# EAGLE design Selecta Pi Shield V1_1 (EAGLE 9.6.2)

## Sheet 1 of 3
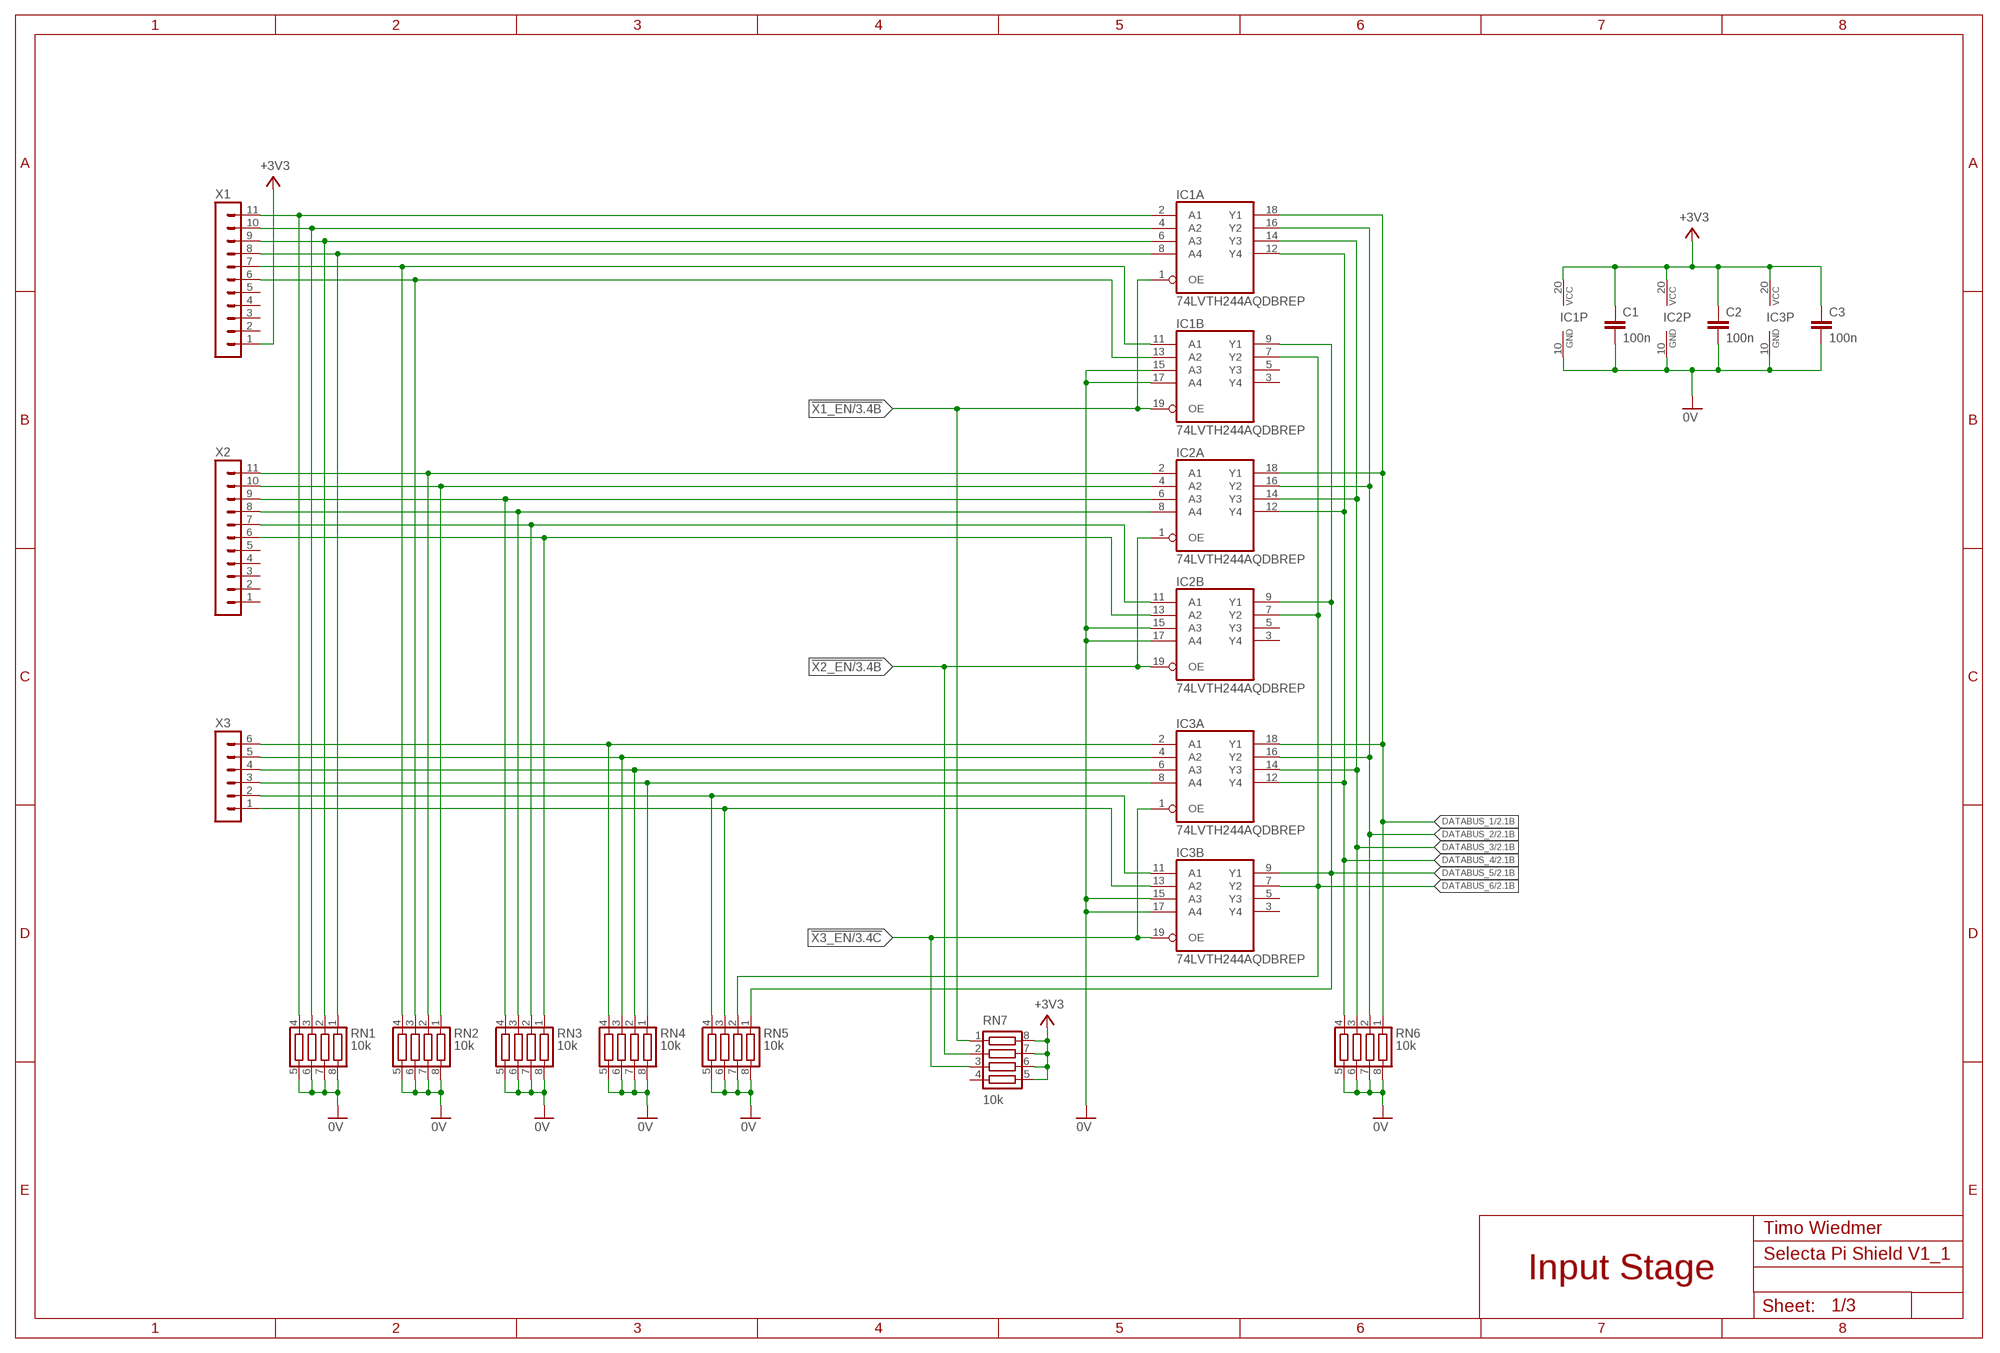
[diagram p0: schematic, sheet 1]

### Parts
C1  100n  C-EUC0603  [C0603]
C2  100n  C-EUC0603  [C0603]
C3  100n  C-EUC0603  [C0603]
IC1  74LVTH244AQDBREP  74244AQDBREP  [SSOP20]
IC2  74LVTH244AQDBREP  74244AQDBREP  [SSOP20]
IC3  74LVTH244AQDBREP  74244AQDBREP  [SSOP20]
RN1  10k  CTS742C083  [CTS742C083]
RN2  10k  CTS742C083  [CTS742C083]
RN3  10k  CTS742C083  [CTS742C083]
RN4  10k  CTS742C083  [CTS742C083]
RN5  10k  CTS742C083  [CTS742C083]
RN6  10k  CTS742C083  [CTS742C083]
RN7  10k  CTS742C083  [CTS742C083]
X1  MA11-1  [MA11-1]
X2  MA11-1  [MA11-1]
X3  MA06-1  [MA06-1]

### Nets
0V: C1.2 C2.2 C3.2 IC1.10(P:GND) IC1.15(B:A3) IC1.17(B:A4) IC2.10(P:GND) IC2.15(B:A3) IC2.17(B:A4) IC3.10(P:GND) IC3.15(B:A3) IC3.17(B:A4) RN1.5 RN1.6 RN1.7 RN1.8 RN2.5 RN2.6 RN2.7 RN2.8 RN3.5 RN3.6 RN3.7 RN3.8 RN4.5 RN4.6 RN4.7 RN4.8 RN5.5 RN5.6 RN5.7 RN5.8 RN6.5 RN6.6 RN6.7 RN6.8 ; also sheet 2,3
!X1_EN: IC1.1(A:OE) IC1.19(B:OE) RN7.1 ; also sheet 3
!X2_EN: IC2.1(A:OE) IC2.19(B:OE) RN7.2 ; also sheet 3
!X3_EN: IC3.1(A:OE) IC3.19(B:OE) RN7.3 ; also sheet 3
+3V3: C1.1 C2.1 C3.1 IC1.20(P:VCC) IC2.20(P:VCC) IC3.20(P:VCC) RN7.5 RN7.6 RN7.7 RN7.8 X1.1 ; also sheet 2,3
B_SELECT1: IC3.2(A:A1) RN4.4 X3.6
B_SELECT2: IC3.4(A:A2) RN4.3 X3.5
B_SELECT3: IC3.6(A:A3) RN4.2 X3.4
B_SELECT4: IC3.8(A:A4) RN4.1 X3.3
B_SELECT5: IC3.11(B:A1) RN5.4 X3.2
B_SELECT6: IC3.13(B:A2) RN5.3 X3.1
DATABUS_1: IC1.18(A:Y1) IC2.18(A:Y1) IC3.18(A:Y1) RN6.1 ; also sheet 2,3
DATABUS_2: IC1.16(A:Y2) IC2.16(A:Y2) IC3.16(A:Y2) RN6.2 ; also sheet 2,3
DATABUS_3: IC1.14(A:Y3) IC2.14(A:Y3) IC3.14(A:Y3) RN6.3 ; also sheet 2,3
DATABUS_4: IC1.12(A:Y4) IC2.12(A:Y4) IC3.12(A:Y4) RN6.4 ; also sheet 2,3
DATABUS_5: IC1.9(B:Y1) IC2.9(B:Y1) IC3.9(B:Y1) RN5.1 ; also sheet 2,3
DATABUS_6: IC1.7(B:Y2) IC2.7(B:Y2) IC3.7(B:Y2) RN5.2 ; also sheet 2,3
N$1: IC1.2(A:A1) RN1.4 X1.11
N$2: IC1.4(A:A2) RN1.3 X1.10
N$3: IC1.6(A:A3) RN1.2 X1.9
N$4: IC1.8(A:A4) RN1.1 X1.8
N$5: IC2.2(A:A1) RN2.2 X2.11
N$6: IC2.4(A:A2) RN2.1 X2.10
N$7: IC2.6(A:A3) RN3.4 X2.9
N$8: IC2.8(A:A4) RN3.3 X2.8
N$11: IC1.11(B:A1) RN2.4 X1.7
N$12: IC1.13(B:A2) RN2.3 X1.6
N$13: IC2.11(B:A1) RN3.2 X2.7
N$15: IC2.13(B:A2) RN3.1 X2.6
Unconnected: IC1.3(B:Y4) IC1.5(B:Y3) IC2.3(B:Y4) IC2.5(B:Y3) IC3.3(B:Y4) IC3.5(B:Y3) RN7.4 X1.2 X1.3 X1.4 X1.5 X2.1 X2.2 X2.3 X2.4 X2.5

### Notes on the sheet
- Timo Wiedmer
- Input Stage

## Sheet 2 of 3
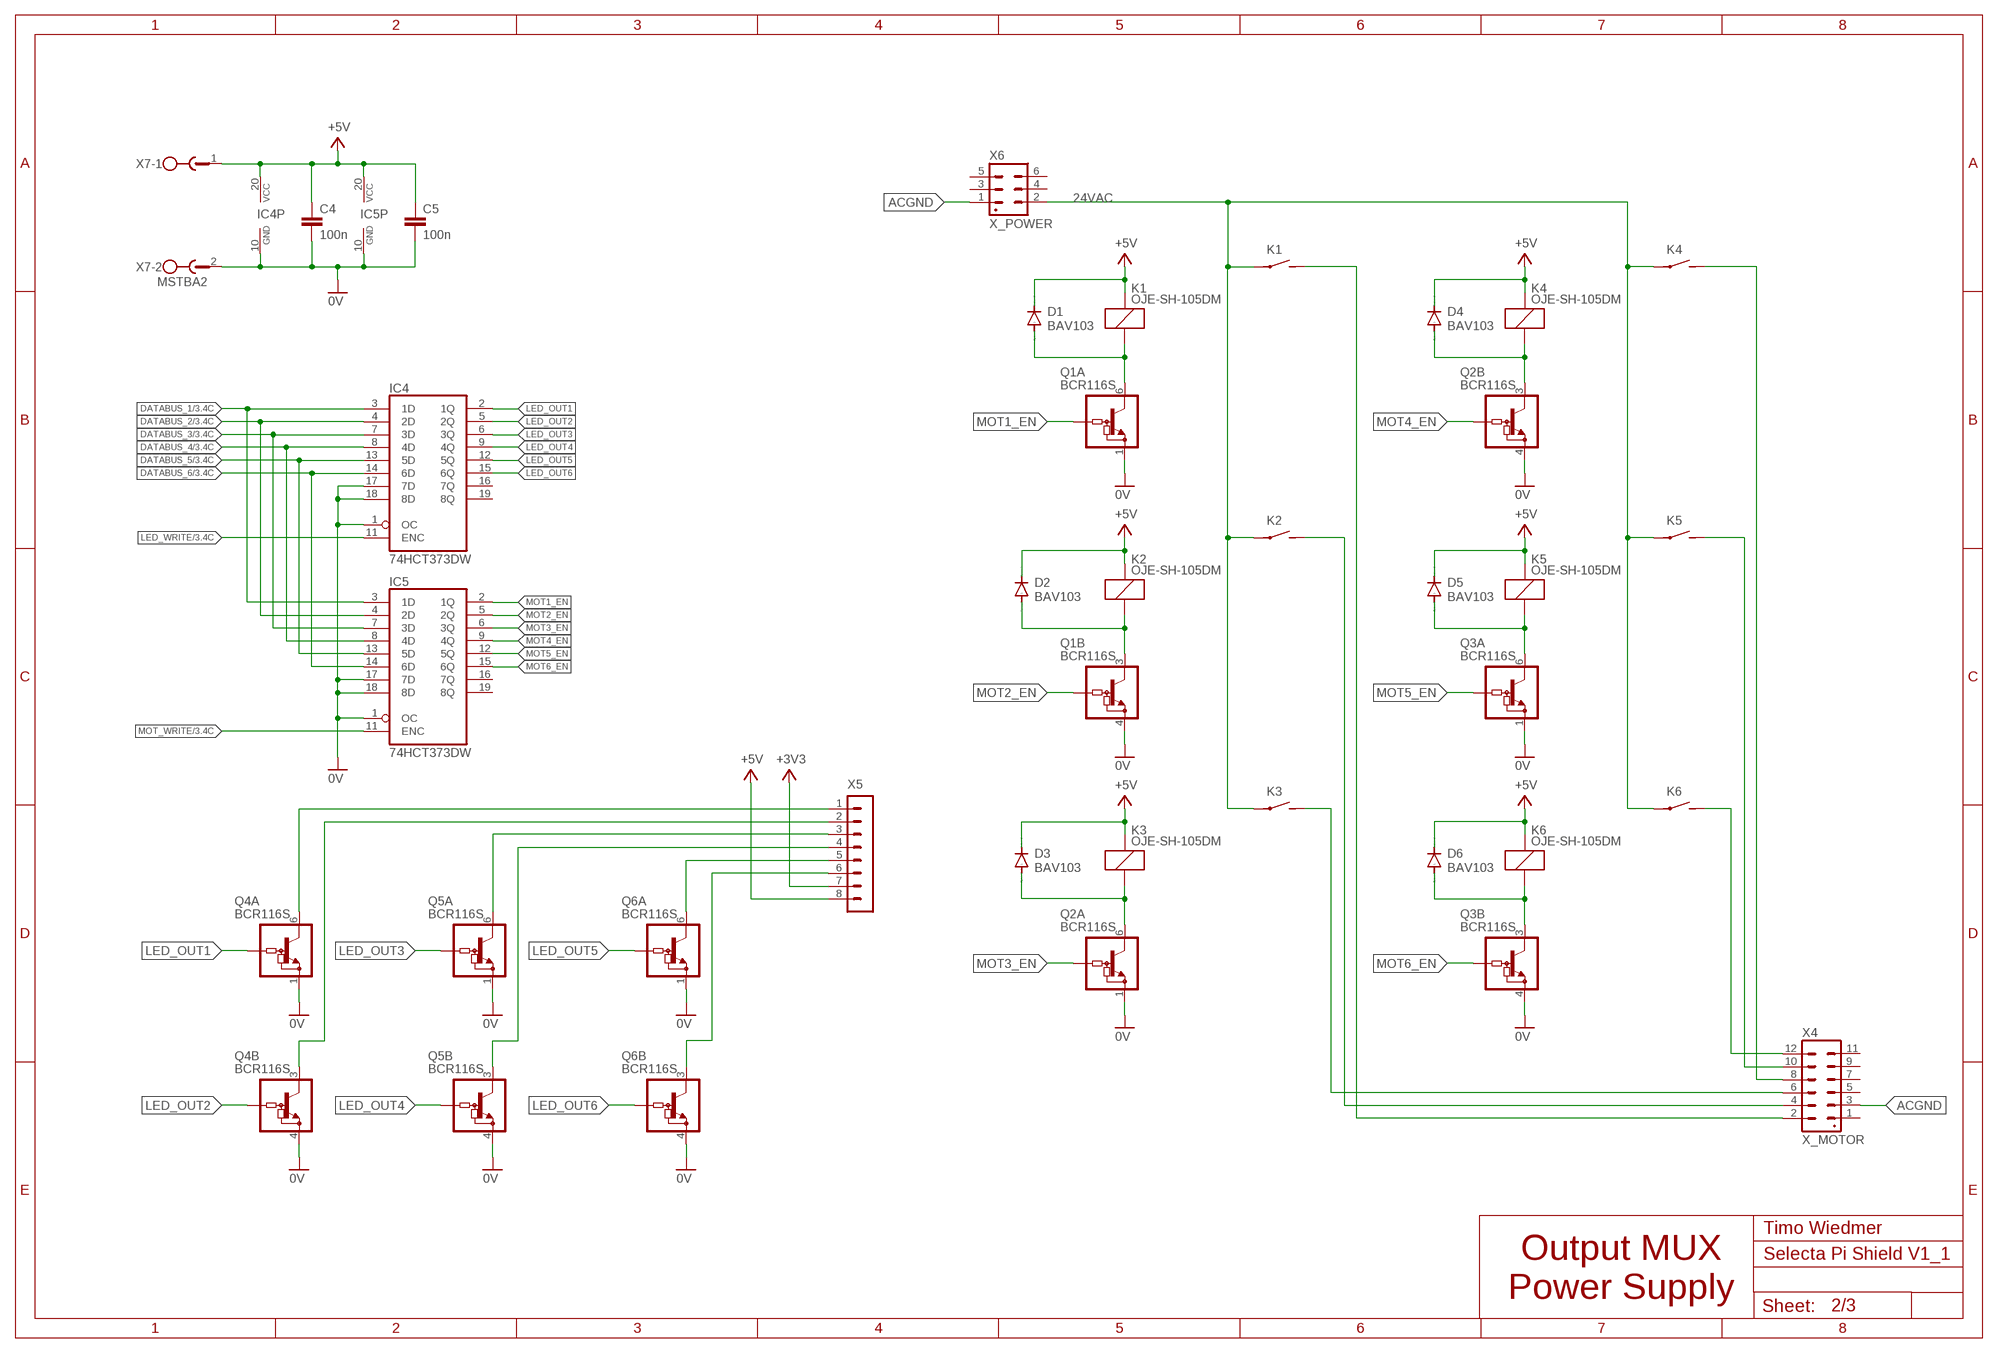
[diagram p1: schematic, sheet 2]

### Parts
C4  100n  C-EUC0603  [C0603]
C5  100n  C-EUC0603  [C0603]
D1  BAV103  [SOD-123_MINI-SMA]
D2  BAV103  [SOD-123_MINI-SMA]
D3  BAV103  [SOD-123_MINI-SMA]
D4  BAV103  [SOD-123_MINI-SMA]
D5  BAV103  [SOD-123_MINI-SMA]
D6  BAV103  [SOD-123_MINI-SMA]
IC4  74HCT373DW  [SO20W]
IC5  74HCT373DW  [SO20W]
K1  OJE-SH-105DM  [OJE-SH-105DM]
K2  OJE-SH-105DM  [OJE-SH-105DM]
K3  OJE-SH-105DM  [OJE-SH-105DM]
K4  OJE-SH-105DM  [OJE-SH-105DM]
K5  OJE-SH-105DM  [OJE-SH-105DM]
K6  OJE-SH-105DM  [OJE-SH-105DM]
Q1  BCR116S  [SOT363]
Q2  BCR116S  [SOT363]
Q3  BCR116S  [SOT363]
Q4  BCR116S  [SOT363]
Q5  BCR116S  [SOT363]
Q6  BCR116S  [SOT363]
X4  X_MOTOR  12P_MINI_FIT  [12P_MINI_FIT]
X5  MA08-1  [MA08-1]
X6  X_POWER  6P_MINI_FIT  [6P_MINI_FIT]
X7  MSTBA2  [MSTBA2]

### Nets
0V: C4.2 C5.2 IC4.1(OC) IC4.10(GND) IC4.17(7D) IC4.18(8D) IC5.1(OC) IC5.10(GND) IC5.17(7D) IC5.18(8D) Q1.1(A:E) Q1.4(B:E) Q2.1(A:E) Q2.4(B:E) Q3.1(A:E) Q3.4(B:E) Q4.1(A:E) Q4.4(B:E) Q5.1(A:E) Q5.4(B:E) Q6.1(A:E) Q6.4(B:E) X7.2 ; also sheet 1,3
24VAC: K1.COM(A:COM) K2.COM(A:COM) K3.COM(A:COM) K4.COM(A:COM) K5.COM(A:COM) K6.COM(A:COM) X6.2
24VAC_MOT1: K1.NO(A:NO) X4.2
24VAC_MOT2: K2.NO(A:NO) X4.4
24VAC_MOT3: K3.NO(A:NO) X4.6
24VAC_MOT4: K4.NO(A:NO) X4.8
24VAC_MOT5: K5.NO(A:NO) X4.10
24VAC_MOT6: K6.NO(A:NO) X4.12
+3V3: X5.7 ; also sheet 1,3
+5V: C4.1 C5.1 D1.C D2.C D3.C D4.C D5.C D6.C IC4.20(VCC) IC5.20(VCC) K1.COILA K2.COILA K3.COILA K4.COILA K5.COILA K6.COILA X5.8 X7.1 ; also sheet 3
ACGND: X4.3 X6.1
DATABUS_1: IC4.3(1D) IC5.3(1D) ; also sheet 1,3
DATABUS_2: IC4.4(2D) IC5.4(2D) ; also sheet 1,3
DATABUS_3: IC4.7(3D) IC5.7(3D) ; also sheet 1,3
DATABUS_4: IC4.8(4D) IC5.8(4D) ; also sheet 1,3
DATABUS_5: IC4.13(5D) IC5.13(5D) ; also sheet 1,3
DATABUS_6: IC4.14(6D) IC5.14(6D) ; also sheet 1,3
LED1: Q4.6(A:C) X5.1
LED2: Q4.3(B:C) X5.2
LED3: Q5.6(A:C) X5.3
LED4: Q5.3(B:C) X5.4
LED5: Q6.6(A:C) X5.5
LED6: Q6.3(B:C) X5.6
LED_OUT1: IC4.2(1Q) Q4.2(A:B)
LED_OUT2: IC4.5(2Q) Q4.5(B:B)
LED_OUT3: IC4.6(3Q) Q5.2(A:B)
LED_OUT4: IC4.9(4Q) Q5.5(B:B)
LED_OUT5: IC4.12(5Q) Q6.2(A:B)
LED_OUT6: IC4.15(6Q) Q6.5(B:B)
LED_WRITE: IC4.11(ENC) ; also sheet 3
MOT1_EN: IC5.2(1Q) Q1.2(A:B)
MOT2_EN: IC5.5(2Q) Q1.5(B:B)
MOT3_EN: IC5.6(3Q) Q2.2(A:B)
MOT4_EN: IC5.9(4Q) Q2.5(B:B)
MOT5_EN: IC5.12(5Q) Q3.2(A:B)
MOT6_EN: IC5.15(6Q) Q3.5(B:B)
MOT_WRITE: IC5.11(ENC) ; also sheet 3
N$27: D3.A K3.COILB Q2.6(A:C)
N$28: D6.A K6.COILB Q3.3(B:C)
N$29: D5.A K5.COILB Q3.6(A:C)
N$30: D2.A K2.COILB Q1.3(B:C)
N$31: D1.A K1.COILB Q1.6(A:C)
N$32: D4.A K4.COILB Q2.3(B:C)
Unconnected: IC4.16(7Q) IC4.19(8Q) IC5.16(7Q) IC5.19(8Q) X4.1 X4.5 X4.7 X4.9 X4.11 X6.3 X6.4 X6.5 X6.6

### Notes on the sheet
- Timo Wiedmer
- Output MUX
  Power Supply

## Sheet 3 of 3
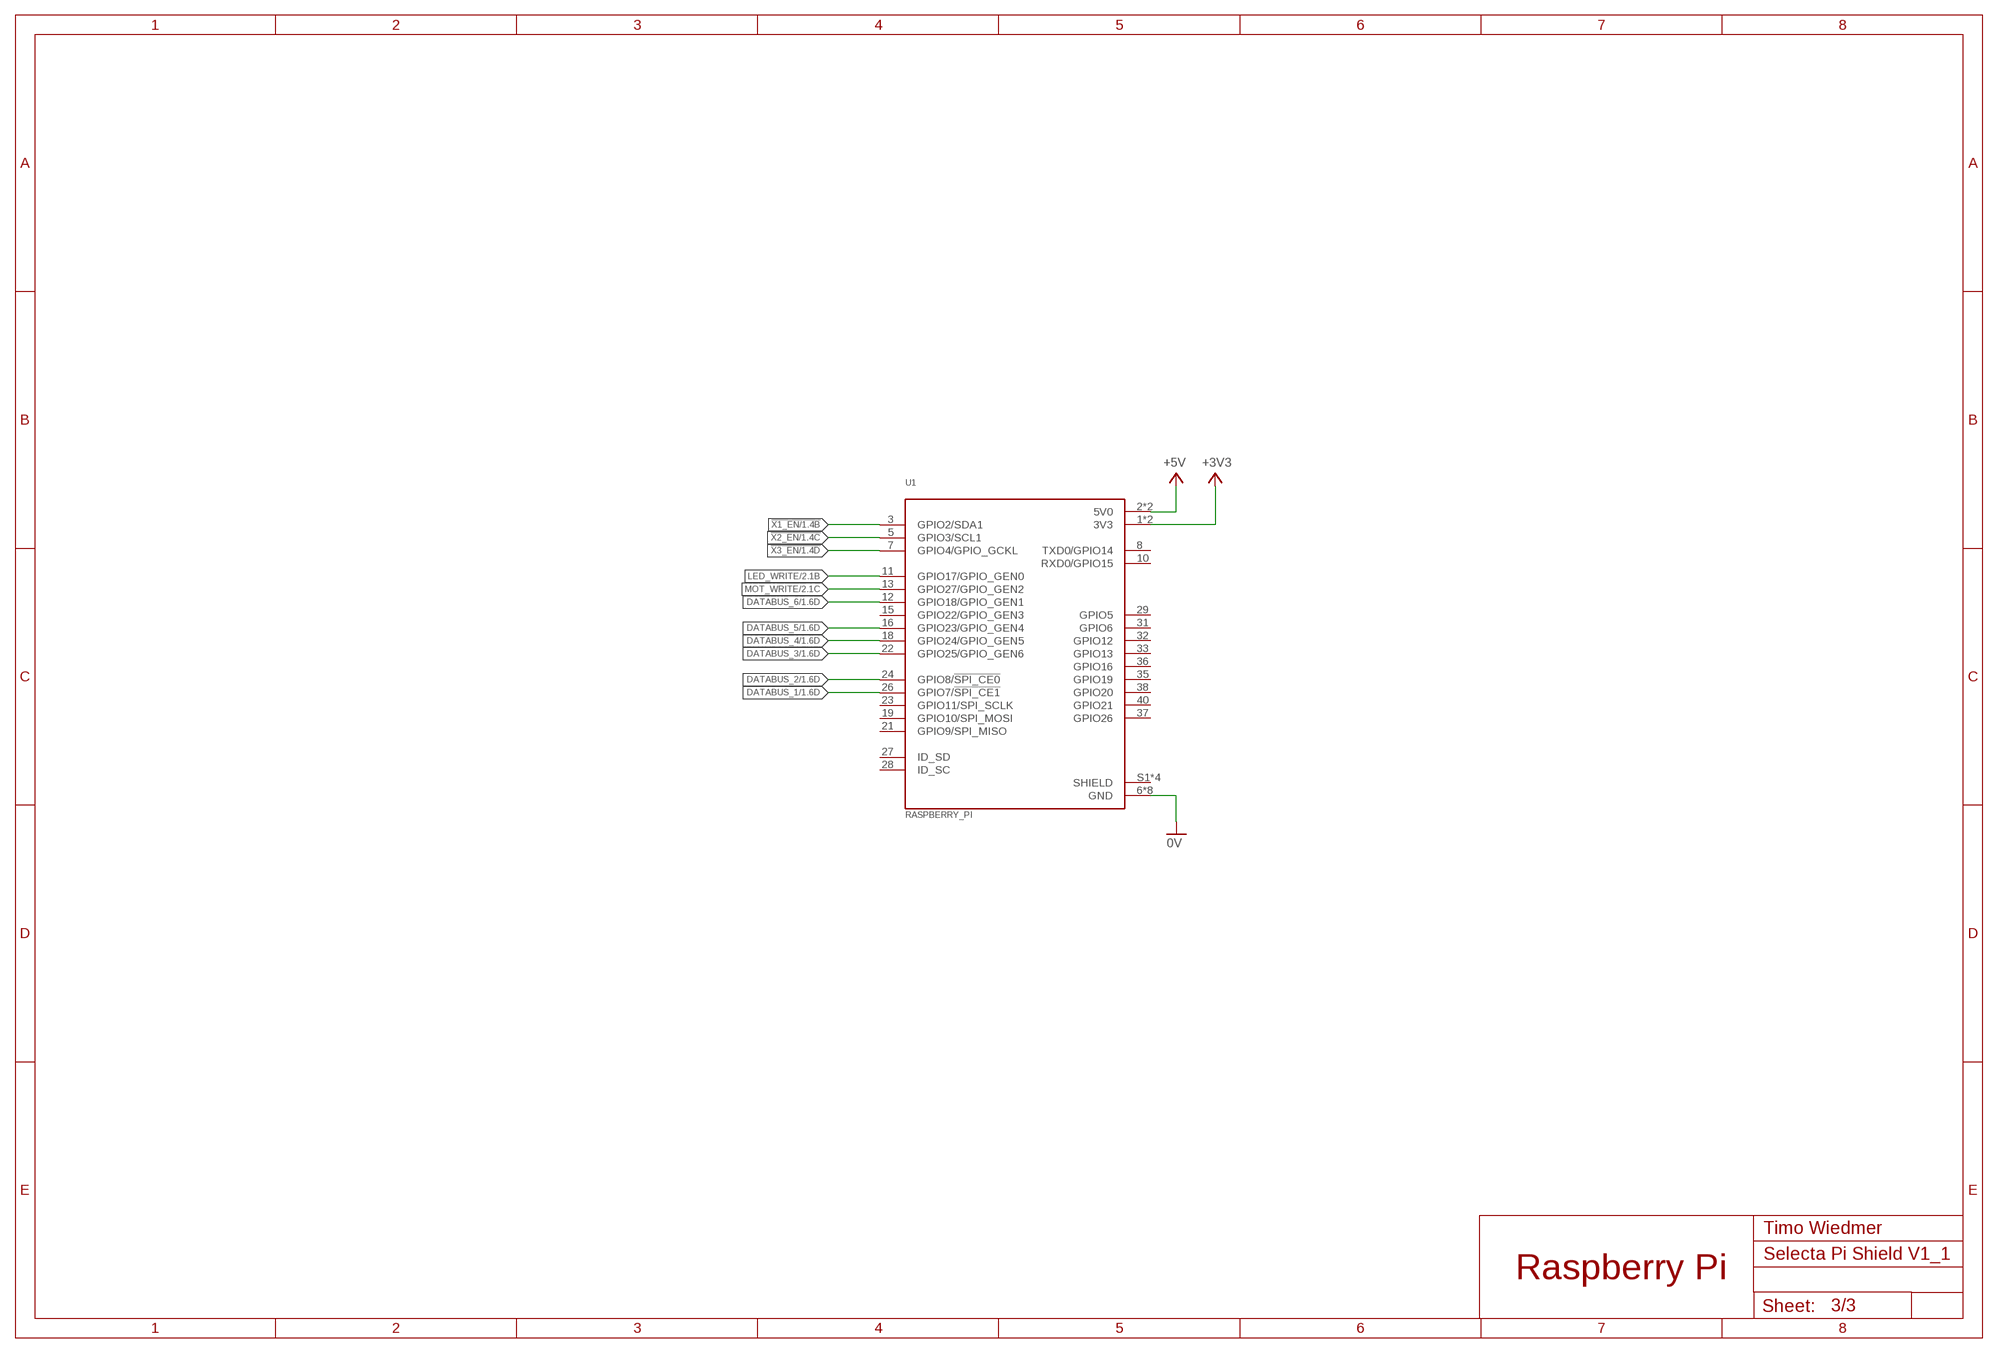
[diagram p2: schematic, sheet 3]

### Parts
U1  RASPBERRY_PI  [RASPBERRY_PI]

### Nets
0V: U1.6(GND) U1.9(GND) U1.14(GND) U1.20(GND) U1.25(GND) U1.30(GND) U1.34(GND) U1.39(GND) ; also sheet 1,2
!X1_EN: U1.3(GPIO2/SDA1) ; also sheet 1
!X2_EN: U1.5(GPIO3/SCL1) ; also sheet 1
!X3_EN: U1.7(GPIO4/GPIO_GCKL) ; also sheet 1
+3V3: U1.1(3V3) U1.17(3V3) ; also sheet 1,2
+5V: U1.2(5V0) U1.4(5V0) ; also sheet 2
DATABUS_1: U1.26(GPIO7/!SPI_CE1!) ; also sheet 1,2
DATABUS_2: U1.24(GPIO8/!SPI_CE0!) ; also sheet 1,2
DATABUS_3: U1.22(GPIO25/GPIO_GEN6) ; also sheet 1,2
DATABUS_4: U1.18(GPIO24/GPIO_GEN5) ; also sheet 1,2
DATABUS_5: U1.16(GPIO23/GPIO_GEN4) ; also sheet 1,2
DATABUS_6: U1.12(GPIO18/GPIO_GEN1) ; also sheet 1,2
LED_WRITE: U1.11(GPIO17/GPIO_GEN0) ; also sheet 2
MOT_WRITE: U1.13(GPIO27/GPIO_GEN2) ; also sheet 2
Unconnected: U1.8(TXD0/GPIO14) U1.10(RXD0/GPIO15) U1.15(GPIO22/GPIO_GEN3) U1.19(GPIO10/SPI_MOSI) U1.21(GPIO9/SPI_MISO) U1.23(GPIO11/SPI_SCLK) U1.27(ID_SD) U1.28(ID_SC) U1.29(GPIO5) U1.31(GPIO6) U1.32(GPIO12) U1.33(GPIO13) U1.35(GPIO19) U1.36(GPIO16) U1.37(GPIO26) U1.38(GPIO20) U1.40(GPIO21)

### Notes on the sheet
- Timo Wiedmer
- Raspberry Pi

## Power pins joined to a net without a drawn wire
SHIELD: U1.S1(SHIELD) U1.S2(SHIELD) U1.S3(SHIELD) U1.S4(SHIELD)

## Library data of the parts
C1-C5 = rcl:C-EU: CAPACITOR, European symbol; SPICEPREFIX: C
D1-D6 = Selecta Pi Shield Parts:BAV103
IC1-IC3 = Selecta Pi Shield Parts:74*244: Octal BUFFER and LINE DRIVER, 3-state
IC4 IC5 = 74xx-eu:74*373: Octal D type transparent LATCH, edge triggered
K1-K6 = Selecta Pi Shield Parts:OJE-SH-105DM
Q1-Q6 = Selecta Pi Shield Parts:BCR116
RN1-RN7 = resistor-net:CTS742C083: Chip Resistor Array 4 Single Resistor Source: http://www.ctscorp.com/components/Datasheets/CTSChipArrayDs.pdf; OC_FARNELL: unknown; OC_NEWARK: unknown
U1 = Selecta Pi Shield Parts:RASPBERRY_PI: BCM2835 Raspberry Pi Model B+ - ARM11, VideoCore MPU Embedded Evaluation Board Check availability <https://pricing.snapeda.com/parts/RASPBERRY%20PI%203%20MODEL%20B%2B/Raspberry%20Pi/view-part?ref=eda>; AVAILABILITY: Not in stock; DESCRIPTION: RASPBERRY PI 3 MOD B+ BCM2837B0; MF: Raspberry Pi; MP: RASPBERRY PI 3 MODEL B+; PACKAGE: None; PRICE: None
X1 X2 = Selecta Pi Shield Parts:MA11-1
X3 = Selecta Pi Shield Parts:MA06-1: PIN HEADER; OC_FARNELL: unknown; OC_NEWARK: unknown
X4 = Selecta Pi Shield Parts:12P_MINI_FIT
X5 = Selecta Pi Shield Parts:MA08-1: PIN HEADER; OC_FARNELL: unknown; OC_NEWARK: unknown
X6 = Selecta Pi Shield Parts:6P_MINI_FIT
X7 = con-phoenix-508:MSTBA2: PHOENIX; MF: FARNELL; MPN: 1757242; OC_FARNELL: 3705171; OC_NEWARK: 71C4161

## Board
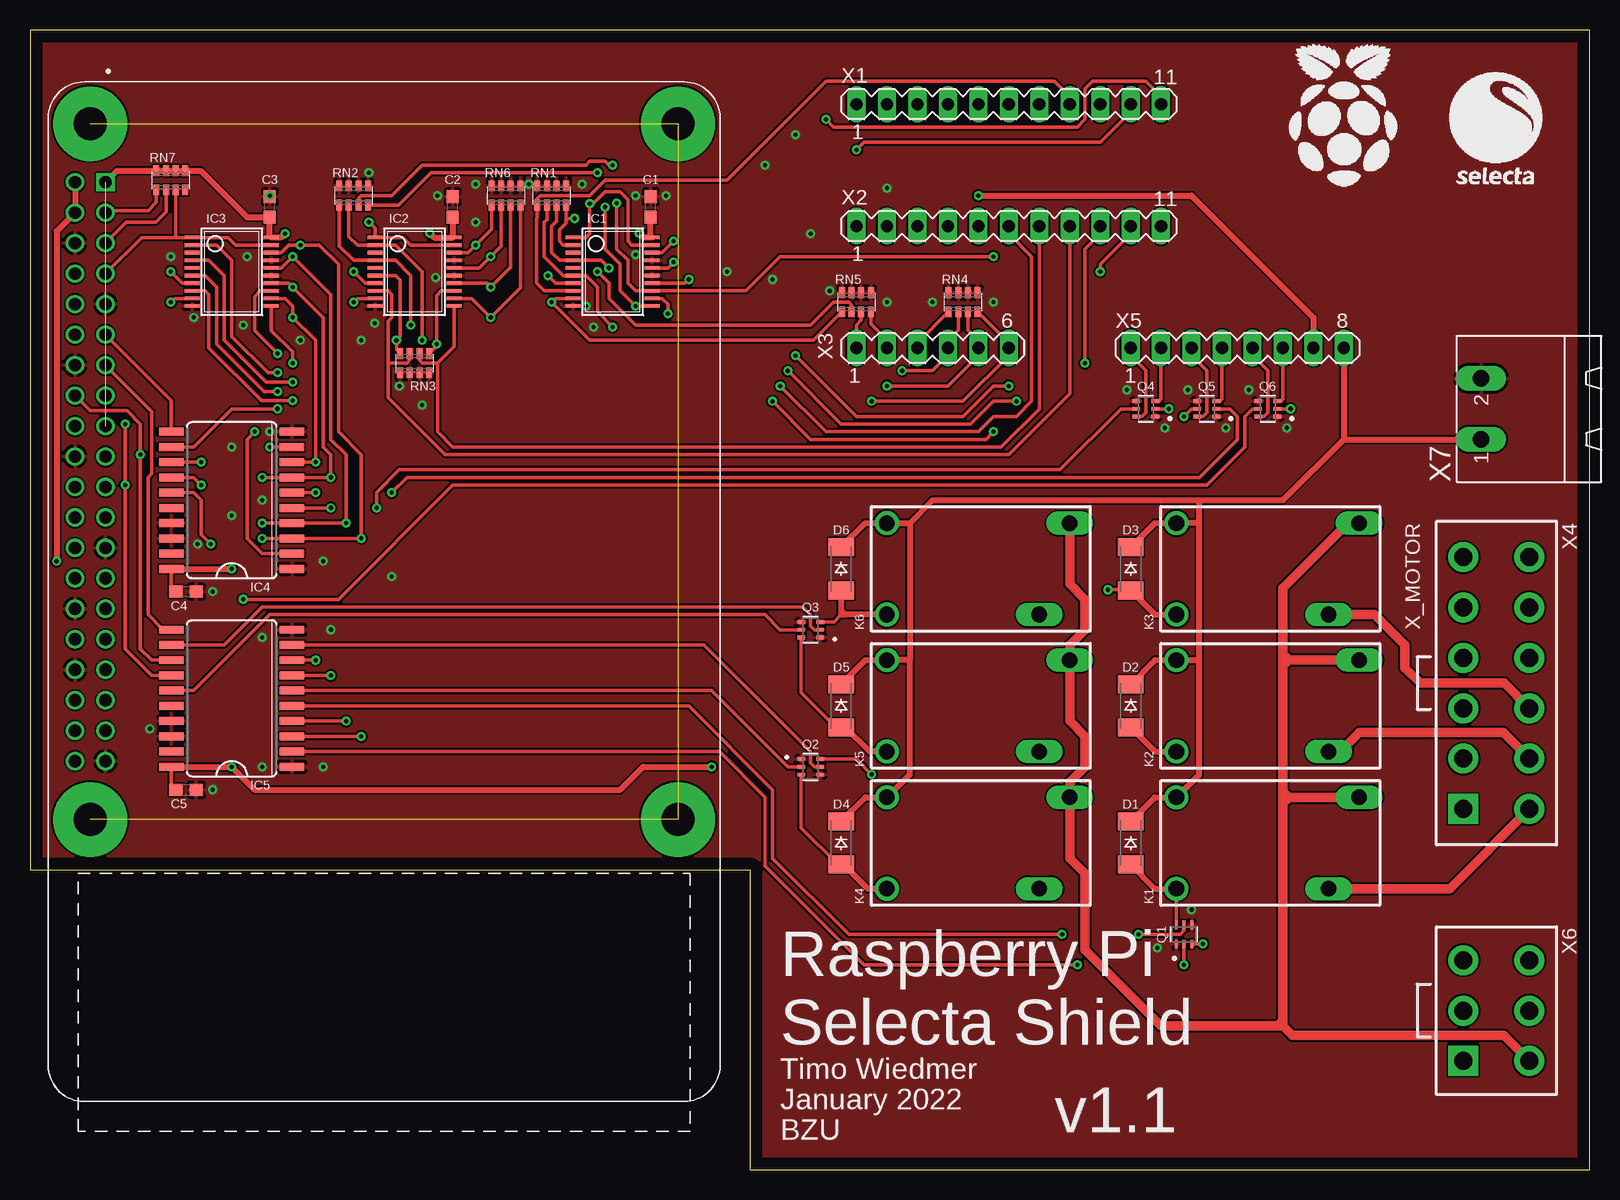
[diagram p3: board, top side]
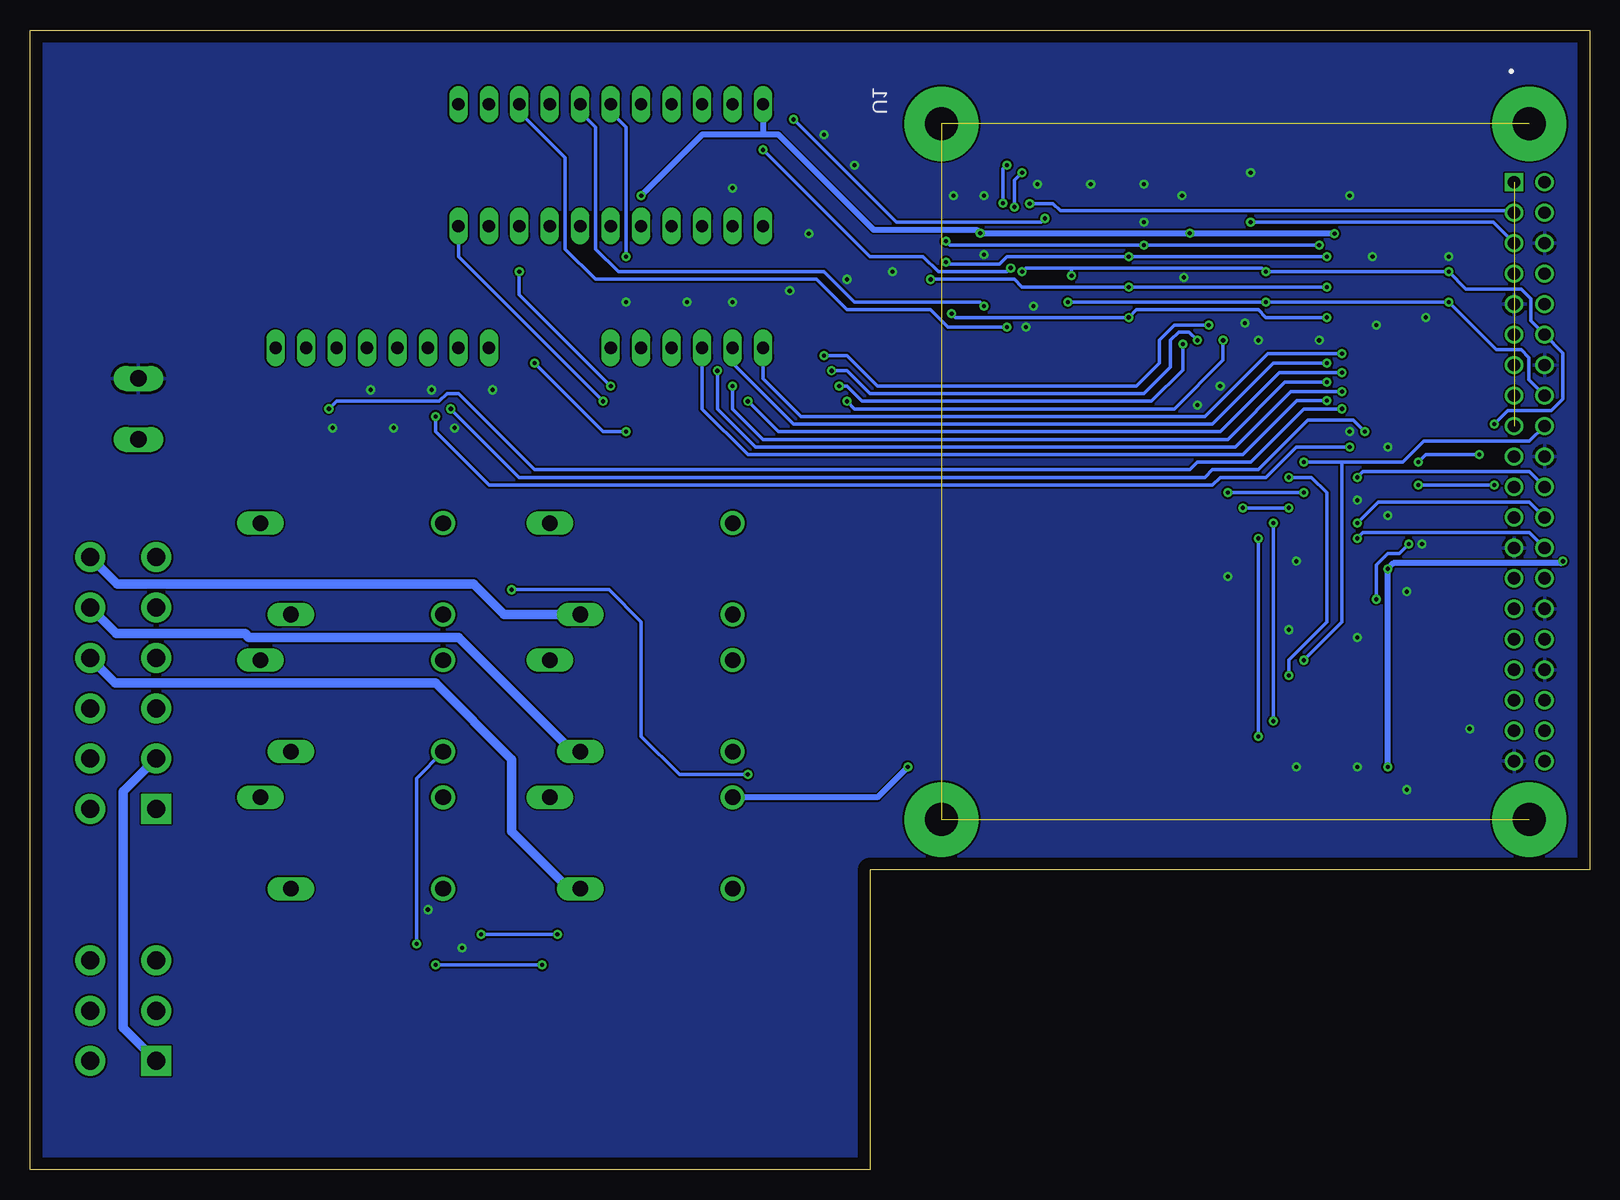
[diagram p4: board, bottom side, seen from below]

Size 130 x 95 mm. Coordinates in mm from the lower left corner, seen from the top.
Outline: 0,25 60,25 60,0 130,0 130,95 0,95 0,25
Copper layers (1*16): Top 0.035mm / dielectric 1.5mm / Bottom 0.035mm
Design rules "default *": minimum track width 6mil, minimum drill 0.35mm, track to track 6mil, track to pad 6mil, pad to pad 6mil, via to via 6mil, smd to smd 6mil, copper to edge 40mil, drill to drill 6mil, minimum pad ring 10mil, minimum via ring 8mil, stop-mask expansion 4mil, vias tented up to drill 0mil, thermal gap 10mil

### Footprints (pad centres in the part's own frame; a part is rotated, then mirrored left to right if it is on the bottom)
C0603 = smd 1.1 x 1: 1 -0.85,0; 2 0.85,0
SOD-123_MINI-SMA = smd 1.5 x 2.1: A 1.8,0; C -1.8,0
SSOP20 = smd 0.305 x 1.245: 1 -2.857,-3.302; 2 -2.222,-3.302; 3 -1.587,-3.302; 4 -0.952,-3.302; 5 -0.317,-3.302; 6 0.318,-3.302; 7 0.953,-3.302; 8 1.588,-3.302; 9 2.223,-3.302; 10 2.858,-3.302; 11 2.858,3.302; 12 2.223,3.302; 13 1.588,3.302; 14 0.953,3.302; 15 0.318,3.302; 16 -0.317,3.302; 17 -0.952,3.302; 18 -1.587,3.302; 19 -2.222,3.302; 20 -2.857,3.302
SO20W = smd 0.66 x 2.032: 1 -5.715,-5.029; 2 -4.445,-5.029; 3 -3.175,-5.029; 4 -1.905,-5.029; 5 -0.635,-5.029; 6 0.635,-5.029; 7 1.905,-5.029; 8 3.175,-5.029; 9 4.445,-5.029; 10 5.715,-5.029; 11 5.715,5.029; 12 4.445,5.029; 13 3.175,5.029; 14 1.905,5.029; 15 0.635,5.029; 16 -0.635,5.029; 17 -1.905,5.029; 18 -3.175,5.029; 19 -4.445,5.029; 20 -5.715,5.029
OJE-SH-105DM = drill 1.3 pad 2: COILA -7.62,3.81; COILB -7.62,-3.81 | drill 1.3 long: COM 7.62,3.81; NO 5.08,-3.81
SOT363 = smd 0.7 x 0.3: 1 -0.8,0.65; 2 -0.8,0; 3 -0.8,-0.65; 4 0.8,-0.65; 5 0.8,0; 6 0.8,0.65
CTS742C083 = smd 0.5 x 0.9: 1 -1.2,-0.8; 2 -0.4,-0.8; 3 0.4,-0.8; 4 1.2,-0.8; 5 1.2,0.8; 6 0.4,0.8; 7 -0.4,0.8; 8 -1.2,0.8
RASPBERRY_PI = drill 1.016 square: 1 9.05,4.71 | drill 1.016: 2 9.05,2.17; 3 11.59,4.71; 4 11.59,2.17; 5 14.13,4.71; 6 14.13,2.17; 7 16.67,4.71; 8 16.67,2.17; 9 19.21,4.71; 10 19.21,2.17; 11 21.75,4.71; 12 21.75,2.17; 13 24.29,4.71; 14 24.29,2.17; 15 26.83,4.71; 16 26.83,2.17; 17 29.37,4.71; 18 29.37,2.17; 19 31.91,4.71; 20 31.91,2.17; 21 34.45,4.71; 22 34.45,2.17; 23 36.99,4.71; 24 36.99,2.17; 25 39.53,4.71; 26 39.53,2.17; 27 42.07,4.71; 28 42.07,2.17; 29 44.61,4.71; 30 44.61,2.17; 31 47.15,4.71; 32 47.15,2.17; 33 49.69,4.71; 34 49.69,2.17; 35 52.23,4.71; 36 52.23,2.17; 37 54.77,4.71; 38 54.77,2.17; 39 57.31,4.71; 40 57.31,2.17 | drill 2.75 pad 6.2: S1 4.18,3.44; S2 62.18,3.44; S3 62.18,52.44; S4 4.18,52.44
MA11-1 = drill 1.016 long: 1 -13.97,0; 2 -11.43,0; 3 -8.89,0; 4 -6.35,0; 5 -3.81,0; 6 -1.27,0; 7 1.27,0; 8 3.81,0; 9 6.35,0; 10 8.89,0; 11 11.43,0
MA06-1 = drill 1.016 long: 1 -6.35,0; 2 -3.81,0; 3 -1.27,0; 4 1.27,0; 5 3.81,0; 6 6.35,0
12P_MINI_FIT = drill 1.5 pad 2.5 square: 1 10.5,-2.75 | drill 1.5 pad 2.5: 2 10.5,2.75; 3 6.3,-2.75; 4 6.3,2.75; 5 2.1,-2.75; 6 2.1,2.75; 7 -2.1,-2.75; 8 -2.1,2.75; 9 -6.3,-2.75; 10 -6.3,2.75; 11 -10.5,-2.75; 12 -10.5,2.75
MA08-1 = drill 1.016 long: 1 -8.89,0; 2 -6.35,0; 3 -3.81,0; 4 -1.27,0; 5 1.27,0; 6 3.81,0; 7 6.35,0; 8 8.89,0
6P_MINI_FIT = drill 1.5 pad 2.5 square: 1 4.2,-2.75 | drill 1.5 pad 2.5: 2 4.2,2.75; 3 0,-2.75; 4 0,2.75; 5 -4.2,-2.75; 6 -4.2,2.75
MSTBA2 = drill 1.397 long: 1 -2.54,5.08; 2 2.54,5.08

### Placement (x,y rotation side)
C1  51.74,80.24 90 top
C2  35.23,80.24 90 top
C3  19.99,80.24 90 top
C4  13.01,48.17 0 top
C5  13.01,31.66 0 top
D1  91.75,27.22 270 top
D2  91.75,38.65 270 top
D3  91.75,50.08 270 top
D4  67.62,27.22 270 top
D5  67.62,38.65 270 top
D6  67.62,50.08 270 top
IC1  48.57,74.84 270 top
IC2  32.06,74.84 270 top
IC3  16.82,74.84 270 top
IC4  16.82,55.8 90 top
IC5  16.82,39.28 90 top
K1  103.18,27.22 0 top
K2  103.18,38.65 0 top
K3  103.18,50.08 0 top
K4  79.05,27.22 0 top
K5  79.05,38.65 0 top
K6  79.05,50.08 0 top
Q1  96.19,19.6 90 top
Q2  65.08,33.57 0 top
Q3  65.08,45 180 top
Q4  93.02,63.41 180 top
Q5  98.1,63.41 180 top
Q6  103.18,63.41 180 top
RN1  43.49,81.19 0 top
RN2  26.98,81.19 0 top
RN3  32.06,67.22 180 top
RN4  77.78,72.31 0 top
RN5  68.89,72.31 0 top
RN6  39.68,81.19 0 top
RN7  11.74,82.47 0 top
U1  1.58,91.35 270 top
U$1  [RASPBERRY_LOGO]  109.53,86.91 0 top
U$2  [SELECTA_LOGO]  122.23,87.55 0 top
X1  82.86,88.81 0 top
X2  82.86,78.66 0 top
X3  75.24,68.5 0 top
X4  122.23,40.55 270 top
X5  100.64,68.5 0 top
X6  122.23,13.25 270 top
X7  126.04,63.41 90 top

### Tracks (layer width: path | path; a pad name or v marks a point on that pad's centre or on a via)
0V  (via drill 0.35)
  other vias: 41.59,82.15 19.99,81.19 28.25,83.1 37.14,82.15 46.03,82.15 75.24,72.31 80.32,72.31 66.67,73.26 71.43,72.31 33.97,81.19 53.02,81.19 50.48,81.19 91.43,65 96.51,65 101.59,65 94.61,61.83 99.69,61.83 104.77,61.83 19.99,61.51 30.16,49.45 24.44,50.72 25.08,45 19.36,44.37 15.23,48.17 30.79,65.32 46.35,71.99 19.36,33.57 15.23,31.66 63.81,86.28 61.27,83.73 24.44,33.57 32.7,63.73 16.82,54.52 37.14,78.97 50.48,76.27 33.81,74.37 18.09,76.11 13.65,71.03 11.74,76.11 17.77,70.4 28.73,70.56 58.09,74.84 61.91,74.21 46.98,70.24 9.99,36.74 13.96,52.14 19.36,55.8 16.82,60.24 27.62,69.13 71.43,81.83 65.08,78.02 22.53,69.13 96.83,21.66 93.97,18.49
  pour Top: 0,95 0,25 60,25 60,0 130,0 130,95
  pour Bottom: 0,95 0,25 60,25 60,0 130,0 130,95
24VAC
  Top 0.8: K6.COM 86.67,48.81 87.94,47.54 87.94,45 86.67,43.73 K5.COM 86.67,37.38 87.94,36.11 87.94,33.57 86.67,32.3 K4.COM 86.67,25.95 87.94,24.68 87.94,18.33 94.29,11.98 103.97,11.98 | K3.COM 109.85,53.89 104.45,48.49 104.45,43.73 104.45,42.94 | 104.45,42.94 104.45,42.46 | K2.COM 104.93,42.46 | 104.93,42.46 104.45,42.46 | 104.45,42.46 104.45,41.98 | 104.45,41.98 104.45,31.51 | 104.45,31.51 104.45,31.03 | 104.45,31.03 104.93,31.03 | 104.93,31.03 K1.COM | X6.2 122.84,11.19 105.24,11.19 104.45,11.98 | 103.97,11.98 104.45,11.98 | 104.45,11.98 104.45,12.46 | 104.45,12.46 104.45,30.55 | 104.45,30.55 104.45,31.03 | 103.97,11.98 104.45,12.46 | 104.45,30.55 104.93,31.03 | 104.45,31.51 104.93,31.03 | 104.93,42.46 104.45,41.98 | 104.45,42.94 104.93,42.46
24VAC_MOT1
  Top 0.8: X4.2 118.34,23.41 K1.NO
24VAC_MOT2
  Top 0.8: X4.4 122.81,36.43 110.8,36.43 109.21,34.84 K2.NO
24VAC_MOT3
  Top 0.8: K3.NO 112.07,46.27 114.61,43.73 114.61,41.83 115.88,40.55 122.88,40.55 X4.6
24VAC_MOT4
  Bottom 0.8: X4.8 122.88,40.55 96.19,40.55 89.84,34.2 89.84,28.17 85.08,23.41 K4.NO
24VAC_MOT5
  Bottom 0.8: X4.10 122.81,44.68 112.07,44.68 111.75,44.37 94.29,44.37 84.77,34.84 K5.NO
24VAC_MOT6
  Bottom 0.8: K6.NO 90.48,46.27 93.02,48.81 122.73,48.81 X4.12
!X1_EN  (via drill 0.35)
  Top 0.3: IC1.19 50.16,77.07 49.84,77.38 49.84,80.87 49.2,81.51 47.94,81.51 46.94,80.51 v46.66,80.51 46.66,78.02 46.35,77.7 IC1.1 | U1.3 6.45,79.92 9.84,79.92 10.54,80.63 RN7.1
  Bottom 0.3: v46.66,80.51 44.71,80.51 44.12,79.92 6.45,79.92 U1.3
!X2_EN  (via drill 0.35)
  Top 0.3: v28.25,78.97 28.76,78.47 IC2.1 31.11,77.7 31.74,77.07 IC2.19 | RN7.2 11.34,79.84 10.47,78.97 8.04,78.97 U1.5
  Bottom 0.3: U1.5 8.04,78.97 v28.25,78.97
!X3_EN
  Top 0.3: U1.7 9.31,77.7 12.06,77.7 | 12.06,77.7 IC3.1 16.5,77.7 17.14,77.07 IC3.19 | RN7.3 12.14,77.78 12.06,77.7
+3V3  (via drill 0.35)  (1 unrouted)
  Top 0.3: IC3.20 19.99,77.83 | IC1.20 51.74,77.83 | 35.23,77.7 IC2.20
  Top 0.5: 19.99,77.83 C3.1 18.09,79.39 14.22,83.27 RN7.5 RN7.6 RN7.7 RN7.8 7.25,83.27 U1.1 | 51.74,77.83 C1.1 | IC1.20 51.16,77.7 v50.79,78.07 | v33.33,78.07 33.69,77.7 35.23,77.7 C2.1 | v21.26,78.03 20.93,77.7 IC3.20 | v79.05,81.19 96.83,81.19 106.99,71.03 X5.7
  Bottom 0.3: 21.3,78.07 v21.26,78.03
  Bottom 0.5: 21.3,78.07 v33.33,78.07 v50.79,78.07 51.06,78.34 59.68,78.34 67.62,86.28 68.89,86.28 | X1.1 68.89,86.28 | v79.05,81.19 73.97,86.28 68.89,86.28
+5V  (via drill 0.35)
  Top 0.3: C5.1 11.79,32.03 IC5.20 | C4.1 11.79,48.54 IC4.20
  Top 0.5: IC5.20 v16.82,33.57 18.73,31.66 49.2,31.66 51.11,33.57 v56.83,33.57 | IC4.20 v16.82,50.08 | U1.2 U1.4 2.22,78.23 v2.22,50.72 | D3.C 93.76,53.89 K3.COILA 97.47,53.89 | D6.C 69.63,53.89 K6.COILA 73.34,53.89 | D2.C 93.76,42.46 K2.COILA 97.47,42.46 | D1.C 93.76,31.03 K1.COILA 97.47,32.94 97.47,42.46 | D4.C 69.63,31.03 K4.COILA 73.34,32.94 73.34,42.46 | D5.C 69.63,42.46 K5.COILA 73.34,42.46 | 97.47,42.46 97.47,53.89 | 73.34,53.89 73.34,42.46 | 97.47,53.89 97.47,55.8 | 73.34,53.89 75.24,55.8 97.47,55.8 | 109.53,60.88 104.45,55.8 97.47,55.8 | 109.53,60.88 X7.1 | X5.8 109.53,60.88
  Bottom 0.5: v16.82,33.57 v16.82,50.08 16.34,50.56 2.37,50.56 v2.22,50.72 | v56.83,33.57 59.37,31.03 K4.COILA
ACGND
  Bottom 0.8: X6.1 122.23,11.8 122.23,31.51 X4.3
B_SELECT1  (via drill 0.35)
  Top 0.3: RN4.4 81.59,68.89 X3.6 81.59,67.86 77.78,64.05 v70.16,64.05 | v20.63,66.43 19.84,66.43 16.82,69.45 16.82,75.8 15.55,77.07 IC3.2
  Bottom 0.3: v70.16,64.05 67.62,61.51 30.79,61.51 25.87,66.43 v20.63,66.43
B_SELECT2  (via drill 0.35)
  Top 0.3: RN4.3 78.18,70 79.05,69.13 X3.5 79.05,67.86 76.51,65.32 v71.43,65.32 | v21.9,65.64 19.68,65.64 16.19,69.13 16.19,74.53 14.91,75.8 IC3.4
  Bottom 0.3: v71.43,65.32 71.43,63.41 68.89,60.88 30.16,60.88 25.39,65.64 v21.9,65.64
B_SELECT3  (via drill 0.35)
  Top 0.3: RN4.2 77.38,70 76.51,69.13 X3.4 76.51,67.86 75.24,66.59 v72.7,66.59 | v20.63,64.84 19.52,64.84 15.55,68.81 15.55,73.58 14.6,74.53 IC3.6
  Bottom 0.3: v72.7,66.59 72.7,63.41 69.53,60.24 29.52,60.24 24.92,64.84 v20.63,64.84
B_SELECT4  (via drill 0.35)
  Top 0.3: RN4.1 73.97,68.89 X3.3 | IC3.8 14.6,73.26 14.91,72.94 14.91,68.5 19.31,64.1 v21.9,64.1
  Bottom 0.3: v21.9,64.1 24.39,64.1 28.89,59.61 70.16,59.61 73.97,63.41 X3.3
B_SELECT5  (via drill 0.35)
  Top 0.3: RN5.4 70.09,70.47 71.43,69.13 X3.2 | IC3.11 20.12,69.96 21.9,68.18 v21.9,67.22
  Bottom 0.3: X3.2 71.43,67.22 66.35,62.14 31.43,62.14 26.34,67.22 v21.9,67.22
B_SELECT6  (via drill 0.35)
  Top 0.3: RN5.3 69.29,70.8 68.89,70.4 X3.1 | v20.63,68.02 18.73,69.92 18.73,72.78 19.2,73.26 IC3.13
  Bottom 0.3: X3.1 68.89,65.95 65.72,62.78 32.06,62.78 26.82,68.02 v20.63,68.02
DATABUS_1  (via drill 0.35)
  Top 0.3: IC3.18 20.95,76.43 21.58,77.07 v22.53,77.07 24.12,77.07 25.71,75.48 25.71,61.51 27.62,59.61 v27.62,52.62 IC4.3 v19.36,52.62 | IC2.18 36.5,76.43 v37.14,77.07 38.48,78.41 RN6.1 | IC1.18 52.7,76.43 v53.65,77.38 | v27.62,36.11 IC5.3
  Bottom 0.3: v53.65,77.38 53.33,77.07 v37.14,77.07 v22.53,77.07 | v27.62,52.62 v27.62,36.11 | U1.26 5.02,53.1 18.88,53.1 v19.36,52.62
DATABUS_2  (via drill 0.35)
  Top 0.3: IC3.16 20.95,75.16 v21.9,76.11 25.08,72.94 25.08,60.88 26.34,59.61 v26.34,53.89 IC4.4 v19.36,53.89 | IC2.16 37.46,75.16 v38.41,76.11 39.28,76.98 RN6.2 | IC1.16 53.17,75.16 v53.65,75.64 | IC5.4 v26.34,37.38
  Bottom 0.3: v21.9,76.11 v38.41,76.11 48.57,76.11 49.2,75.48 53.49,75.48 v53.65,75.64 | v26.34,37.38 v26.34,53.89 | U1.24 5.02,55.64 17.61,55.64 v19.36,53.89
DATABUS_3  (via drill 0.35)
  Top 0.3: IC3.14 21.58,73.89 v21.9,73.58 24.44,71.03 24.44,60.24 25.08,59.61 v25.08,57.7 IC4.7 v19.36,57.7 | IC2.14 38.09,73.89 v38.41,73.58 40.08,75.25 RN6.3 | IC1.14 54.6,73.89 v54.92,74.21 | IC5.7 v25.08,41.19
  Bottom 0.3: v21.9,73.58 v38.41,73.58 47.3,73.58 47.94,74.21 v54.92,74.21 | v25.08,41.19 25.08,42.46 21.9,45.63 21.9,56.43 23.17,57.7 v25.08,57.7 | U1.22 5.02,58.18 18.88,58.18 v19.36,57.7
DATABUS_4  (via drill 0.35)
  Top 0.3: IC3.12 21.27,72.62 21.9,71.99 v21.9,71.03 23.8,69.13 v23.8,58.97 IC4.8 | IC2.12 36.82,72.62 v38.41,71.03 40.88,73.5 RN6.4 | IC1.12 52.7,72.62 53.17,72.15 v53.17,71.35 | v23.8,42.46 IC5.8
  Bottom 0.3: v53.17,71.35 52.86,71.03 v38.41,71.03 37.77,71.67 27.62,71.67 26.98,71.03 v21.9,71.03 | v23.8,58.97 20.63,58.97 | 20.63,58.97 20.63,45.63 v23.8,42.46 | U1.18 5.02,60.72 13.8,60.72 15.55,58.97 20.63,58.97
DATABUS_5  (via drill 0.35)
  Top 0.3: IC2.9 27.3,72.62 v26.98,72.31 | v11.74,72.31 12.06,72.62 IC3.9 | IC1.9 43.81,72.62 v43.49,72.31 46.66,69.13 65.31,69.13 RN5.1 | IC5.13 10.15,42.46 9.2,43.41 v9.2,59.61 9.2,62.14 8.09,63.26 5.02,63.26 U1.16 | v14.28,58.97 IC4.13
  Bottom 0.3: v43.49,72.31 v26.98,72.31 v11.74,72.31 7.77,68.34 5.71,68.34 5.07,67.7 5.07,65.85 U1.16 | v9.2,59.61 13.65,59.61 v14.28,58.97
DATABUS_6  (via drill 0.35)
  Top 0.3: IC2.7 27.93,73.89 v26.98,74.84 | IC3.7 12.69,73.89 v11.74,74.84 | IC5.14 10.15,41.19 7.93,43.41 v7.93,57.06 v7.93,62.14 | v14.28,57.06 13.65,57.7 IC4.14 | RN5.2 68.49,72.07 68.25,72.31 66.98,72.31 65.08,70.4 50.48,70.4 48.25,72.62 48.25,73.89 | v47.3,74.84 48.25,73.89 | 48.25,73.89 | IC1.7 43.81,73.89 v43.17,74.53
  Bottom 0.3: v47.3,74.84 46.98,75.16 43.17,75.16 | 43.17,75.16 27.3,75.16 v26.98,74.84 v11.74,74.84 10.31,73.42 5.71,73.42 4.91,72.62 4.91,70.77 U1.12 2.22,68.07 2.22,64.21 3.17,63.26 6.82,63.26 v7.93,62.14 | v7.93,57.06 v14.28,57.06 | v43.17,74.53 43.17,75.16
LED1
  Top 0.3: Q4.6 92.69,62.77 93.02,63.1 93.02,66.59 91.75,67.86 X5.1
LED2
  Top 0.3: Q4.3 94.14,64.06 94.29,64.22 X5.2
LED3
  Top 0.3: Q5.6 97.77,62.77 98.1,63.1 98.1,66.59 96.83,67.86 X5.3
LED4
  Top 0.3: Q5.3 99.22,64.06 99.37,64.22 X5.4
LED5
  Top 0.3: Q6.6 102.85,62.77 103.18,63.1 103.18,66.59 101.91,67.86 X5.5
LED6
  Top 0.3: Q6.3 104.3,64.06 104.45,64.22 X5.6
LED_OUT1  (via drill 0.35)
  Top 0.3: v94.92,63.41 Q4.2 | IC4.2 19.36,51.35 18.09,52.62 18.09,60.88 v18.73,61.51
  Bottom 0.3: v18.73,61.51 19.68,62.46 23.49,62.46 27.62,58.34 31.43,58.34 32.06,57.7 89.21,57.7 v94.92,63.41
LED_OUT2  (via drill 0.35)
  Top 0.3: IC4.5 v25.08,55.16 | Q4.5 90.95,63.41 85.87,58.34 30.79,58.34 28.89,56.43 v28.89,55.16
  Bottom 0.3: v28.89,55.16 v25.08,55.16
LED_OUT3  (via drill 0.35)
  Top 0.3: IC4.6 v23.8,56.43 | v30.16,56.43 31.43,57.7 97.47,57.7 100.64,60.88 100.64,62.78 100,63.41 Q5.2
  Bottom 0.3: v23.8,56.43 v30.16,56.43
LED_OUT4  (via drill 0.35)
  Top 0.3: IC4.9 v19.99,60.24 | v96.19,62.78 96.83,63.41 Q5.5
  Bottom 0.3: v19.99,60.24 24.44,60.24 26.98,57.7 30.79,57.7 31.43,57.06 91.75,57.06 96.19,61.51 v96.19,62.78
LED_OUT5  (via drill 0.35)
  Top 0.3: IC4.12 13.65,60.24 16.82,63.41 v20.63,63.41 | v105.09,63.41 Q6.2
  Bottom 0.3: v20.63,63.41 23.8,63.41 28.25,58.97 32.7,58.97 33.33,58.34 87.94,58.34 94.29,64.69 95.24,64.69 95.88,64.05 104.45,64.05 v105.09,63.41
LED_OUT6  (via drill 0.35)
  Top 0.3: Q6.5 101.91,63.41 101.28,62.78 101.28,60.24 98.1,57.06 35.23,57.06 25.71,47.54 v17.77,47.54 | v15.07,52.14 14.28,52.94 14.28,55.8 13.65,56.43 IC4.15
  Bottom 0.3: v17.77,47.54 17.77,50.4 16.82,51.35 15.87,51.35 v15.07,52.14
LED_WRITE
  Top 0.3: U1.11 11.79,64.1 IC4.11
MOT1_EN  (via drill 0.35)
  Top 0.3: IC5.2 57.46,34.84 61.27,31.03 61.27,25.32 69.53,17.06 v87.31,17.06 | v96.19,17.06 Q1.2
  Bottom 0.3: v87.31,17.06 v96.19,17.06
MOT2_EN  (via drill 0.35)
  Top 0.3: Q1.5 96.19,19.92 95.88,19.6 v92.38,19.6 | v86.03,19.6 68.25,19.6 61.91,25.95 61.91,31.66 54.92,38.65 IC5.5
  Bottom 0.3: v92.38,19.6 v86.03,19.6
MOT3_EN
  Top 0.3: IC5.6 56.83,39.92 63.17,33.57 Q2.2
MOT4_EN
  Top 0.3: IC5.9 56.19,43.73 65.08,34.84 65.08,33.89 65.4,33.57 Q2.5
MOT5_EN
  Top 0.3: IC5.12 16.19,43.73 19.36,46.91 64.44,46.91 65.08,46.27 65.08,45.32 65.4,45 Q3.2
MOT6_EN
  Top 0.3: IC5.15 13.65,39.92 19.99,46.27 61.27,46.27 62.54,45 Q3.5
MOT_WRITE
  Top 0.3: IC5.11 11.1,45 9.84,46.27 9.84,57.7 10.15,58.02 10.15,63.2 U1.13
N$1  (via drill 0.35)
  Top 0.3: RN1.4 44.69,79.29 | 44.69,79.29 44.69,78.9 44.12,78.34 44.12,77.38 44.44,77.07 IC1.2 | v45.39,79.29 44.69,79.29 | v66.35,87.55 66.98,86.91 87.31,86.91 87.94,87.55 87.94,90.09 88.58,90.72 93.02,90.72 94.29,89.45 X1.11
  Bottom 0.3: v45.39,79.29 45.71,78.97 57.78,78.97 v66.35,87.55
N$2  (via drill 0.35)
  Top 0.3: RN1.3 43.89,79.06 43.49,78.66 43.49,76.43 44.13,75.8 IC1.4 47.62,75.8 v48.25,75.16 | v68.89,85 69.53,85.64 89.21,85.64 91.75,88.18 X1.10
  Bottom 0.3: v48.25,75.16 48.57,74.84 54.28,74.84 55.55,76.11 60,76.11 v68.89,85
N$3  (via drill 0.35)
  Top 0.3: RN1.2 43.09,79.21 42.86,78.97 42.86,76.11 44.44,74.53 IC1.6 46.35,74.53 47.3,73.58 47.3,71.51 v48.57,70.24
  Bottom 0.3: v48.57,70.24 53.49,70.24 54.92,71.67 61.91,71.67 64.44,74.21 82.86,74.21 85.4,76.75 85.4,84.37 89.21,88.18 X1.9
N$4
  Top 0.3: IC1.8 42.86,73.26 42.22,73.89 42.22,79.29 42.29,79.36 RN1.1 42.29,80.95 42.54,81.19 46.66,81.19 47.94,82.47 58.09,82.47 66.35,90.72 85.4,90.72 86.67,89.45 X1.8
N$5  (via drill 0.35)
  Top 0.3: RN2.2 26.58,77.78 27.3,77.07 IC2.2 30.47,77.07 32.7,74.84 v32.7,69.13 | v82.22,64.05 80.32,64.05 78.41,62.14 67.62,62.14 v63.17,66.59
  Bottom 0.3: v32.7,69.13 33.38,69.81 34.24,69.81 34.92,69.13 34.92,66.91 37.14,64.69 60,64.69 61.91,66.59 v63.17,66.59 | v82.22,64.05 94.29,76.11 X2.11
N$6  (via drill 0.35)
  Top 0.3: RN2.1 25.78,77 26.98,75.8 IC2.4 30.47,75.8 31.74,74.53 v31.74,70.4 | X2.10 91.75,78.02 89.21,75.48 v89.21,74.84 | v63.81,67.86 68.89,62.78 77.78,62.78 80.32,65.32 v81.59,65.32
  Bottom 0.3: v31.74,70.4 34.6,70.4 35.87,69.13 35.87,67.22 37.77,65.32 59.37,65.32 61.91,67.86 v63.81,67.86 | v81.59,65.32 89.21,72.94 v89.21,74.84
N$7  (via drill 0.35)
  Top 0.3: RN3.4 30.54,68.34 v30.54,69.13 30.86,69.45 30.86,74.14 30.47,74.53 IC2.6 | v61.91,64.05 65.08,60.88 79.69,60.88 v80.32,61.51 | v87.94,67.22 87.94,76.75 89.21,78.02 X2.9
  Bottom 0.3: v30.54,69.13 30.54,67.47 34.6,63.41 61.27,63.41 v61.91,64.05 | v80.32,61.51 82.22,61.51 v87.94,67.22
N$8
  Top 0.3: RN3.3 31.66,67.46 31.43,67.22 29.84,67.22 | IC2.8 29.84,73.26 30.16,72.94 30.16,71.03 29.84,70.72 29.84,67.22 | 29.84,67.22 29.84,64.37 34.6,59.61 81.59,59.61 86.67,64.69 X2.8
N$11  (via drill 0.35)
  Top 0.3: IC1.11 v50.48,71.99 49.2,73.26 49.2,75.48 47.94,76.75 v47.94,80.24 | RN2.4 30.72,80.4 33.42,83.1 v47.3,83.1
  Bottom 0.3: v47.3,83.1 47.94,82.47 v47.94,80.24 | v50.48,71.99 50.79,72.31 61.27,72.31 63.81,74.84 80.95,74.84 82.86,76.75 82.86,86.91 84.13,88.18 X1.7
N$12  (via drill 0.35)
  Top 0.3: RN2.3 27.38,80.96 27.62,81.19 30.16,81.19 32.7,83.73 46.35,83.73 46.66,84.05 47.94,84.05 48.25,83.73 v48.57,83.73 | v48.89,80.56 48.89,76.75 49.84,75.8 49.84,73.89 50.48,73.26 IC1.13 59.68,73.26 62.54,76.11 v80.32,76.11
  Bottom 0.3: v48.57,83.73 48.89,83.42 v48.89,80.56 | v80.32,76.11 80.32,86.91 81.59,88.18 X1.6
N$13
  Top 0.3: RN3.2 32.46,67.46 32.7,67.22 33.97,67.22 | 33.97,67.22 35.36,68.62 IC2.11 | X2.7 84.13,63.41 80.95,60.24 35.23,60.24 33.97,61.51 33.97,67.22
N$15  (via drill 0.35)
  Top 0.3: RN3.1 33.89,68.66 v33.89,68.81 33.89,72.87 34.28,73.26 IC2.13 | X2.6 81.59,78.02 83.5,76.11 83.5,64.05 82.22,62.78 80.32,62.78 79.05,61.51 66.35,61.51 v62.54,65.32
  Bottom 0.3: v33.89,68.81 33.89,66.66 36.5,64.05 60.63,64.05 61.91,65.32 v62.54,65.32
N$27  (via drill 0.35)
  Top 0.3: Q2.6 68.88,34.22 v70.16,32.94 | v89.84,48.33 91.7,48.33 D3.A
  Top 0.5: D3.A 93.76,46.27 K3.COILB
  Bottom 0.3: v70.16,32.94 75.88,32.94 79.05,36.11 79.05,45.63 81.75,48.33 v89.84,48.33
N$28
  Top 0.3: Q3.3 67,45.65 67.62,46.27
  Top 0.5: K6.COILB 68.89,46.27 67.94,46.27 | 67.94,46.27 67.62,46.27 67.62,46.59 | D6.A 67.62,46.59 | 67.94,46.27 67.62,46.59
N$29
  Top 0.3: D5.A 67.2,36.85 64.28,39.77 Q3.6
  Top 0.5: K5.COILB 70,34.84 67.99,36.85 D5.A
N$30  (via drill 0.35)
  Top 0.3: v97.78,18.81 v97.78,18.8 Q1.3
  Top 0.5: D2.A 93.76,34.84 K2.COILB
  Bottom 0.3: K2.COILB 97.78,32.62 v97.78,18.81
N$31
  Top 0.3: K1.COILB 95.55,23.39 Q1.6
  Top 0.5: D1.A 93.76,23.41 K1.COILB
N$32
  Top 0.3: Q2.3 64.28,28.5 67.36,25.42 D4.A
  Top 0.5: K4.COILB 69.84,23.41 67.83,25.42 D4.A
SHIELD  (3 unrouted)

### Text on the board
tPlace: Raspberry Pi / Selecta Shield | Timo Wiedmer | January 2022 | v1.1 | BZU